# EAGLE design EMS-ESP8266-12 (EAGLE 7.5.1)
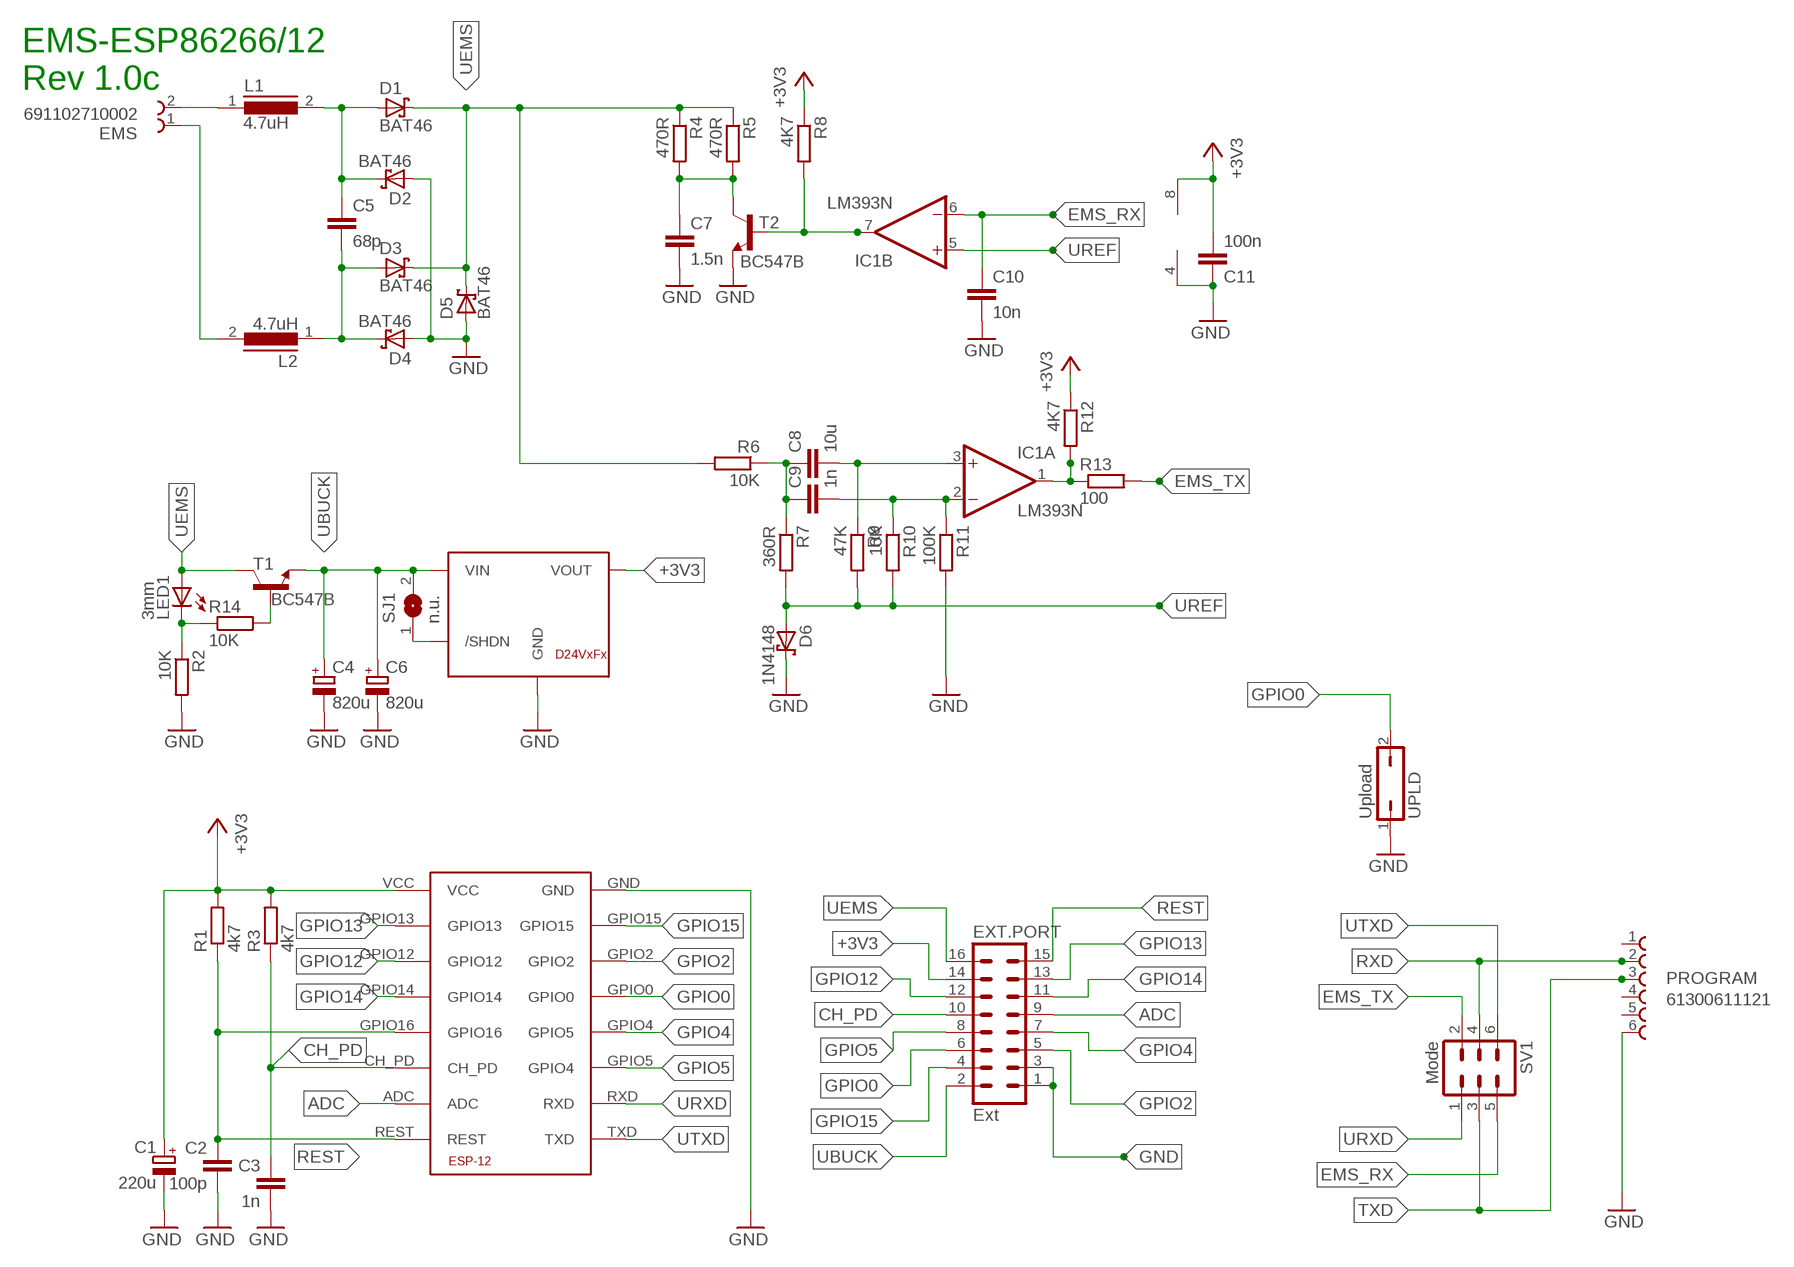
[diagram p0: schematic, sheet 1]

## Parts
C1  220u  CPOL-EUUD-6,3X8,8  [UD-6,3X5,8_NICHICON]
C2  100p  C2.5/2  [C2.5-2]
C3  1n  C2.5/2  [C2.5-2]
C4  820u  CPOL-EUUD-10X10  [UD-10X10_NICHICON]
C5  68p  C-EU025-050X050  [C025-050X050]
C6  820u  CPOL-EUUD-10X10  [UD-10X10_NICHICON]
C7  1.5n  C2.5/2  [C2.5-2]
C8  10u  C5/11  [C5B11]
C9  1n  C2.5/2  [C2.5-2]
C10  10n  C2.5/2  [C2.5-2]
C11  100n  C2.5/2  [C2.5-2]
D1  BAT46  SCHOTTKY-DIODEDO35-7  [DO35-7]
D2  BAT46  SCHOTTKY-DIODEDO35-7  [DO35-7]
D3  BAT46  SCHOTTKY-DIODEDO35-7  [DO35-7]
D4  BAT46  SCHOTTKY-DIODEDO35-7  [DO35-7]
D5  BAT46  SCHOTTKY-DIODEDO35-7  [DO35-7]
D6  1N4148  SCHOTTKY-DIODEDO35-7  [DO35-7]
EMS  691102710002  [691102710002]
ESP1  ESP-12ESP-12  [ESP-12]
EXT.PORT  Ext  MA08-2  [MA08-2]
IC1  LM393N  [DIL08]
L1  4.7uH  MICC12  [MICC12]
L2  4.7uH  MICC12  [MICC12]
LED1  3mm  LED3MM  [LED3MM]
MOD1  D24V3F3  D24VXFX  [D24VXFX]
PROGRAM  61300611121  [61300611121]
R1  4k7  R-EU_0204/7  [0204/7]
R2  10K  R-EU_0204/7  [0204/7]
R3  4k7  R-EU_0204/7  [0204/7]
R4  470R  R-EU_0204/7  [0204/7]
R5  470R  R-EU_0204/7  [0204/7]
R6  10K  R-EU_0204/7  [0204/7]
R7  360R  R-EU_0204/7  [0204/7]
R8  4K7  R-EU_0204/7  [0204/7]
R9  47K  R-EU_0204/7  [0204/7]
R10  10K  R-EU_0204/7  [0204/7]
R11  100K  R-EU_0204/7  [0204/7]
R12  4K7  R-EU_0204/7  [0204/7]
R13  100  R-EU_0204/7  [0204/7]
R14  10K  R-EU_0204/7  [0204/7]
SJ1  n.u.  SJ  [SJ]
SV1  Mode  MA03-2  [MA03-2]
T1  BC547B  -NPN-TO92  [TO92]
T2  BC547B  -NPN-TO92  [TO92]
UPLD  Upload  JP1Q  [JP1]

## Nets
+3V3 [pwr]: C1.+ C11.2 ESP1.VCC EXT.PORT.14 IC1.8(P:V+) MOD1.VOUT R1.2 R3.2 R8.1 R12.1
ADC [signal]: ESP1.ADC EXT.PORT.9
CH_PD [signal]: C3.1 ESP1.CH_PD EXT.PORT.10 R3.1
EMS_RX [signal]: C10.1 IC1.6(B:-IN) SV1.5
EMS_TX [signal]: R13.2 SV1.2
GND [pwr]: C1.- C2.2 C3.2 C4.- C6.- C7.2 C10.2 C11.1 D2.A D4.A D5.A D6.C ESP1.GND EXT.PORT.1 EXT.PORT.3 IC1.4(P:V-) MOD1.GND PROGRAM.6 R2.2 R11.2 T2.1(E) UPLD.1
GPIO0 [signal]: ESP1.GPIO0 EXT.PORT.6 UPLD.2
GPIO2 [signal]: ESP1.GPIO2 EXT.PORT.5
GPIO4 [signal]: ESP1.GPIO4(GPIO5) EXT.PORT.7
GPIO5: ESP1.GPIO5(GPIO4) EXT.PORT.8
GPIO12 [signal]: ESP1.GPIO12 EXT.PORT.12
GPIO13 [signal]: ESP1.GPIO13 EXT.PORT.13
GPIO14 [signal]: ESP1.GPIO14 EXT.PORT.11
GPIO15: ESP1.GPIO15 EXT.PORT.4
N$1 [pwr]: C5.1 D1.A D2.C L1.2
N$2 [pwr]: C5.2 D3.A D4.C L2.1
N$3: MOD1./SHDN SJ1.1
N$4 [pwr]: EMS.2 L1.1
N$5: IC1.1(A:OUT) R12.2 R13.1
N$6 [pwr]: C7.1 R4.2 R5.2 T2.3(C)
N$7: C8.1 C9.1 R6.1 R7.1
N$8 [pwr]: EMS.1 L2.2
N$9: C8.2 IC1.3(A:+IN) R9.1
N$10: R14.2 T1.2(B)
N$12: C9.2 IC1.2(A:-IN) R10.1 R11.1
N$15: IC1.7(B:OUT) R8.2 T2.2(B)
N$17: LED1.K(C) R2.1 R14.1
REST [signal]: C2.1 ESP1.GPIO16 ESP1.REST EXT.PORT.15 R1.1
RXD [signal]: PROGRAM.2 SV1.4
TXD [signal]: PROGRAM.3 SV1.3
UBUCK [pwr]: C4.+ C6.+ EXT.PORT.2 MOD1.VIN SJ1.2 T1.1(E)
UEMS [pwr]: D1.C D3.C D5.C EXT.PORT.16 LED1.A R4.1 R5.1 R6.2 T1.3(C)
UREF: D6.A IC1.5(B:+IN) R7.2 R9.2 R10.2
URXD [signal]: ESP1.RXD SV1.1
UTXD: ESP1.TXD SV1.6
Unconnected: PROGRAM.1 PROGRAM.4 PROGRAM.5

## Notes on the sheet
- EMS-ESP86266/12
  Rev 1.0c

## Library data of the parts
C1 = rcl:CPOL-EU: POLARIZED CAPACITOR, European symbol; REICHELT: VF 220/6,3 P-D
C2 = capacitor-wima:C: CAPACITOR naming: grid - package width; REICHELT: KERKO 100P
C3 C9 = capacitor-wima:C: CAPACITOR naming: grid - package width; REICHELT: X7R-2,5 1,0N
C4 C6 = rcl:CPOL-EU: POLARIZED CAPACITOR, European symbol; REICHELT: VF 820/16 P-G
C5 = resistor:C-EU: CAPACITOR, European symbol; REICHELT: KERKO 68P
C7 = capacitor-wima:C: CAPACITOR naming: grid - package width; REICHELT: X7R-2,5 1,5N
C8 = capacitor-wima:C: CAPACITOR naming: grid - package width; ALTERNATIV: SMD 10uF Keramik; CONRAD: 450662-62; REICHELT: X7R-G1206 10/16
C10 = capacitor-wima:C: CAPACITOR naming: grid - package width; REICHELT: X7R-2,5 10N
C11 = capacitor-wima:C: CAPACITOR naming: grid - package width; REICHELT: X7R-2,5 100N
D1-D4 = diode:SCHOTTKY-DIODE: Schottky Diode; ALTERNATIV: 1/2 BAT54S; REICHELT: BAT 46
D5 = diode:SCHOTTKY-DIODE: Schottky Diode; REICHELT: BAT 46
D6 = diode:SCHOTTKY-DIODE: Schottky Diode; REICHELT: 1N 4148
EMS = EagleLibrary_Wuerth_Elektronik_eiCan_Terminal_Blocks_Connectors_v6_20150113:691102710002: WR-TBL Serie 102 - 5.0mm Horizontal Entry Modular with Pressure Clamp - 1.5mm2 Wires, 2 Pins=>Code : Con_TBL_Screw_PressureClamp_691102710002 <http://katalog.we-online.de/media/images/eican/Con_TBL_Screw_PressureClamp_6911027100xx_pf2.jpg> Details see: http://katalog.we-online.de/en/em/691_102_710_0xx Created 2014-06-17, Karrer Zheng 2014 (C) Würth Elektronik; REICHELT: AKL 055-02
ESP1 = ESP8266-ESP12:ESP-12: low cost Wifi to Serial Module; AI-THINKER: ESP-12
EXT.PORT = con-lstb:MA08-2: PIN HEADER; OC_FARNELL: unknown; OC_NEWARK: unknown; REICHELT: MPE 087-2-016
IC1 = linear:LM393: COMPARATOR; REICHELT: LM 393 DIP
L1 L2 = inductors:MICC12: INDUCTOR; REICHELT: SMCC 4,70µ
LED1 = led:LED: LED OSRAM: - CHIPLED LG R971, LG N971, LY N971, LG Q971, LY Q971, LO R971, LY R971 LH N974, LH R974 LS Q976, LO Q976, LY Q976 LO Q996 - Hyper CHIPLED LW Q18S LB Q993, LB Q99A, LB R99A - SideLED LS A670, LO A670, LY A670, LG A670, LP A670 LB A673, LV A673, LT A673, LW A673 LH A674 LY A675 LS A676, LA A676, LO A676, LY A676, LW A676 LS A679, LY A679, LG A679 - Hyper Micro SIDELED® LS Y876, LA Y876, LO Y876, LY Y876 LT Y87S - SmartLED LW L88C, LW L88S LB L89C, LB L89S, LG L890 LS L89K, LO L89K, LY L89K LS L896, LA L896, LO L896, LY L896 - TOPLED LS T670, LO T670, LY T670, LG T670, LP T670 LSG T670, LSP T670, LSY T670, LOP T670, LYG T670 LG T671, LOG T671, LSG T671 LB T673, LV T673, LT T673, LW T673 LH T674 LS T676, LA T676, LO T676, LY T676, LB T676, LH T676, LSB T676, LW T676 LB T67C, LV T67C, LT T67C, LS T67K, LO T67K, LY T67K, LW E67C LS E67B, LA E67B, LO E67B, LY E67B, LB E67C, LV E67C, LT E67C LW T67C LS T679, LY T679, LG T679 LS T770, LO T770, LY T770, LG T770, LP T770 LB T773, LV T773, LT T773, LW T773 LH T774 LS E675, LA E675, LY E675, LS T675 LS T776, LA T776, LO T776, LY T776, LB T776 LHGB T686 LT T68C, LB T68C - Hyper Mini TOPLED® LB M676 - Mini TOPLED Santana® LG M470 LS M47K, LO M47K, LY M47K Source: http://www.osram.convergy.de LUXEON: - LUMILED® LXK2-PW12-R00, LXK2-PW12-S00, LXK2-PW14-U00, LXK2-PW14-V00 LXK2-PM12-R00, LXK2-PM12-S00, LXK2-PM14-U00 LXK2-PE12-Q00, LXK2-PE12-R00, LXK2-PE12-S00, LXK2-PE14-T00, LXK2-PE14-U00 LXK2-PB12-K00, LXK2-PB12-L00, LXK2-PB12-M00, LXK2-PB14-N00, LXK2-PB14-P00, LXK2-PB14-Q00 LXK2-PR12-L00, LXK2-PR12-M00, LXK2-PR14-Q00, LXK2-PR14-R00 LXK2-PD12-Q00, LXK2-PD12-R00, LXK2-PD12-S00 LXK2-PH12-R00, LXK2-PH12-S00 LXK2-PL12-P00, LXK2-PL12-Q00, LXK2-PL12-R00 Source: www.luxeon.com KINGBRIGHT: KA-3528ASYC Source: www.kingbright.com; REICHELT: LED 3MM ST RT
MOD1 = buckconv:D24VXFX: Step-Down Spannungsregler Hersteller: Pololu Maximum operating voltage: 42 V Maximum output current: 300 mA (D24V3Fx) 600 mA (D24V6Fx) Maximum quiescent current: 2 mA; POLOLU: D24V3F3
PROGRAM = EagleLibrary_Wuerth_Elektronik_eiCan_Board_to_Board_Connectors_v6_20150113:61300611121: WR-PHD 2.54mm Pin Header, 6 Pin =>Code : Con_BTB_PHD_2.54_1_THT_61300611121 <http://katalog.we-online.de/media/images/eican/Con_BTB_PHD_2.54_1_THT_6130xx11121_pf2.jpg> Details see: http://katalog.we-online.de/en/em/613_0xx_111_21 Created 2014-05-29, Karrer Zheng 2014 (C) Würth Elektronik; REICHELT: MPE 087-1-006
R1 R3 R8 R12 = resistor:R-EU_: RESISTOR, European symbol; REICHELT: METALL 4,70K
R2 R6 R10 R14 = resistor:R-EU_: RESISTOR, European symbol; REICHELT: METALL 10,0K
R4 R5 = resistor:R-EU_: RESISTOR, European symbol; REICHELT: METALL 470
R7 = resistor:R-EU_: RESISTOR, European symbol; REICHELT: METALL 360
R9 = resistor:R-EU_: RESISTOR, European symbol; REICHELT: METALL 47,0K
R11 = resistor:R-EU_: RESISTOR, European symbol; REICHELT: METALL 100K
R13 = resistor:R-EU_: RESISTOR, European symbol; REICHELT: METALL 100
SJ1 = jumper:SJ: SMD solder JUMPER
SV1 = con-lstb:MA03-2: PIN HEADER; OC_FARNELL: unknown; OC_NEWARK: unknown; REICHELT: MPE 087-2-006
T1 T2 = transistor:*-NPN-: NPN Transistror BF959 corrected 2008.03.06; REICHELT: BC 547B
UPLD = jumper:JP1Q: JUMPER; REICHELT: MPE 087-1-002

## Net classes
0 default: width 0.254 mm, drill 0.2 mm, clearance 0.254 mm
1 pwr: width 0.508 mm, drill 0.2 mm, clearance 0.205 mm to class 0, clearance 0.254 mm
2 signal: width 0.254 mm, drill 0.2 mm, clearance 0.205 mm to class 0, clearance 0.205 mm to class 1, clearance 0.205 mm

## Board
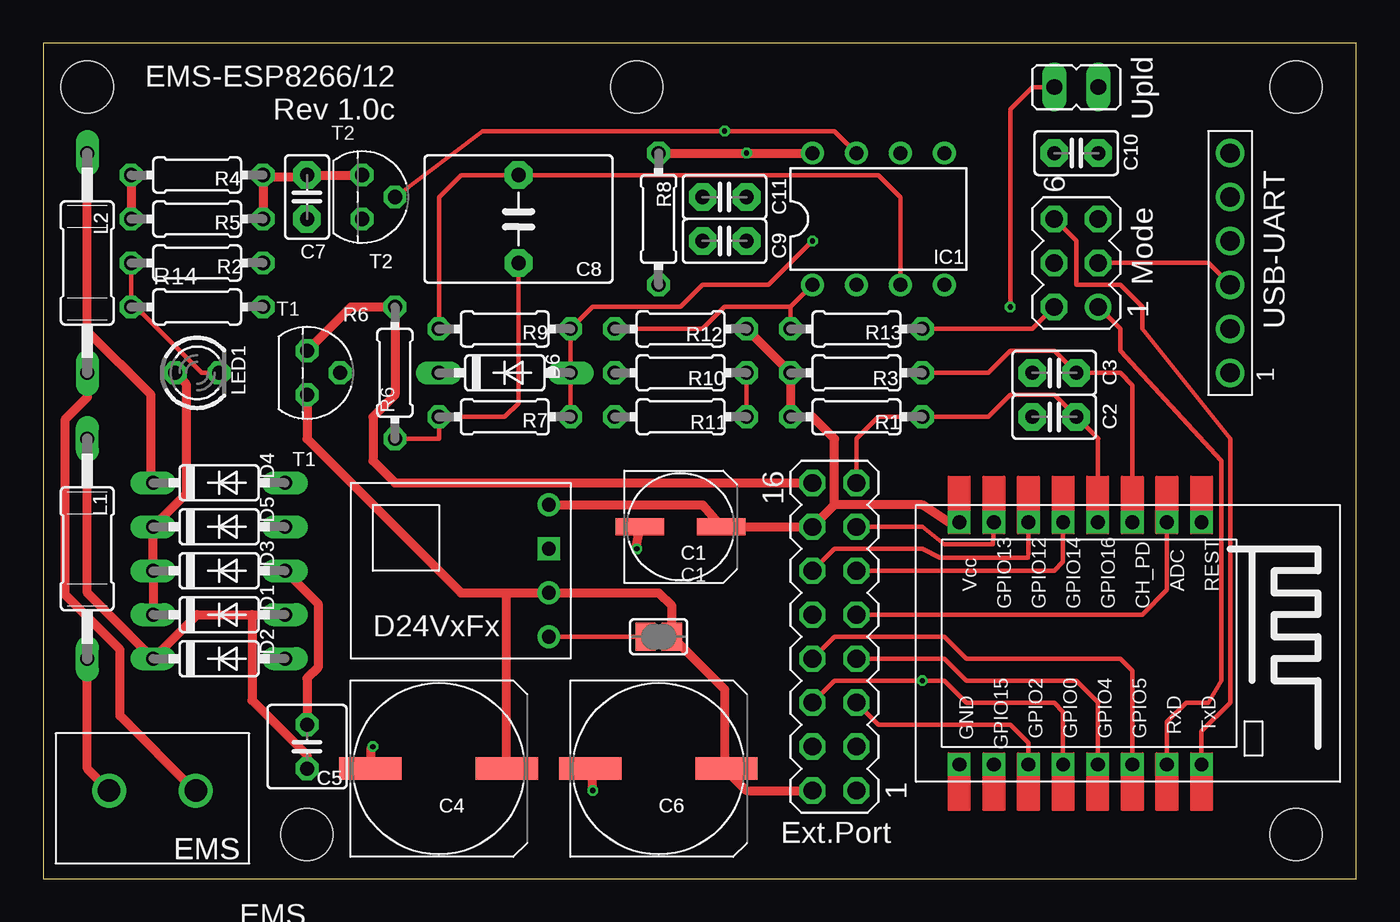
[diagram p1: board, top side]
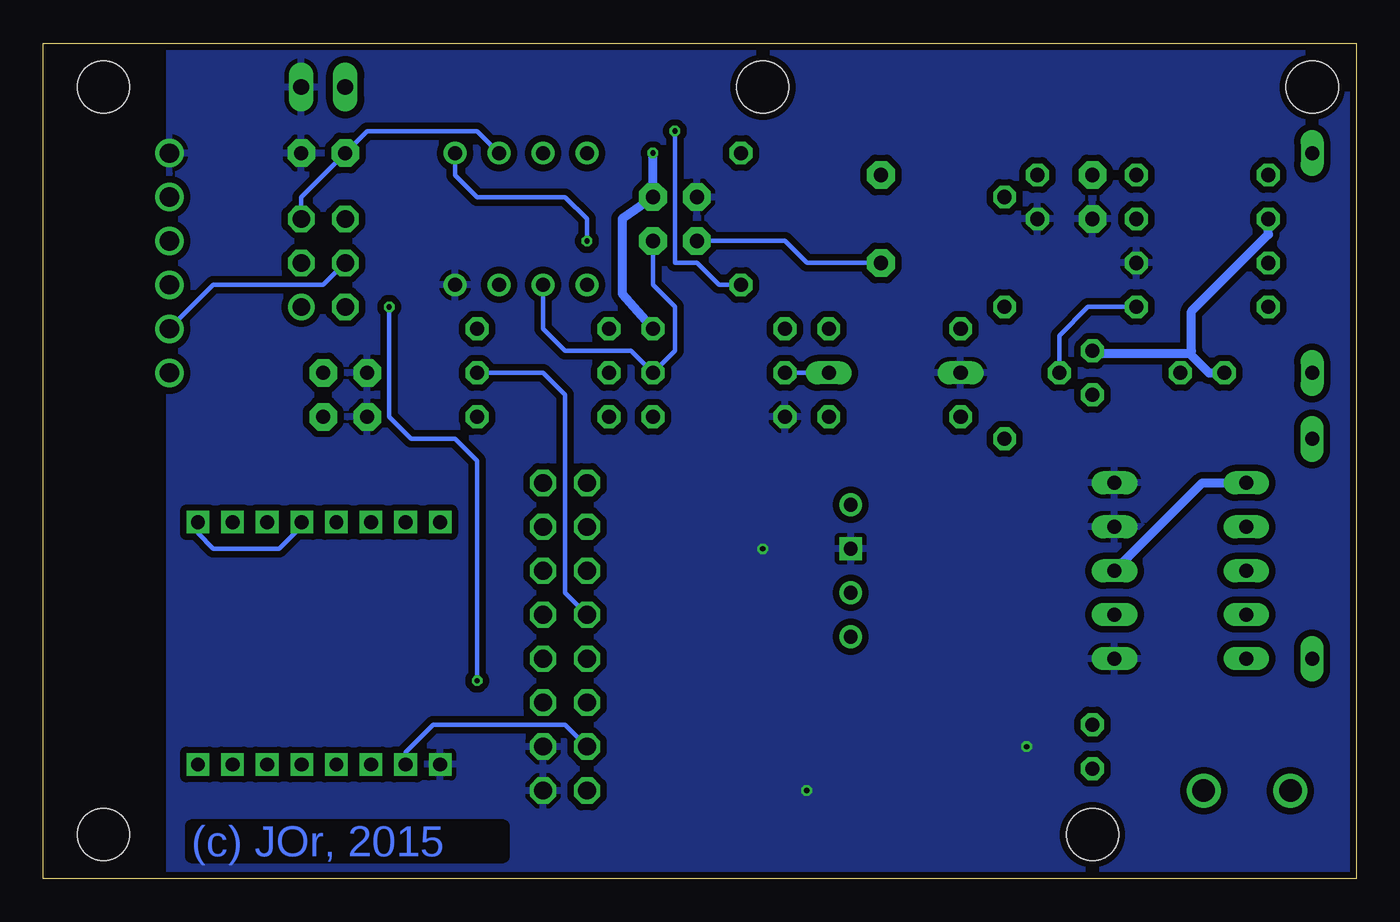
[diagram p2: board, bottom side, seen from below]

Size 75.87 x 48.25 mm. Coordinates in mm from the lower left corner, seen from the top.
Outline: 0,0 75.87,0 75.87,48.25 0,48.25 0,0
Copper layers (1*16): Top 0.035mm / dielectric 1.5mm / Bottom 0.035mm
Design rules "EMS-ESP8266-12": minimum track width 5mil, minimum drill 12mil, track to track 0.205mm, track to pad 0.205mm, pad to pad 0.205mm, via to via 0.205mm, smd to smd 0mil, copper to edge 10mil, drill to drill 10mil, minimum pad ring 10mil, minimum via ring 6mil, stop-mask expansion 2mil, vias tented up to drill 25mil, thermal gap 10mil
Holes 3 mm at 2.54,45.72 72.39,45.72 72.39,2.54 34.29,45.72 15.24,2.54

### Footprints (pad centres in the part's own frame; a part is rotated, then mirrored left to right if it is on the bottom)
UD-6,3X5,8_NICHICON = smd 2.8 x 1: + 2.35,0; - -2.35,0
C2.5-2 = drill 0.813 pad 1.6 octagon: 1 -1.27,0; 2 1.27,0
UD-10X10_NICHICON = smd 3.6 x 1.3: + 3.925,0; - -3.95,0
C025-050X050 = drill 0.813 octagon: 1 -1.27,0; 2 1.27,0
C5B11 = drill 0.813 pad 1.6 octagon: 1 1.27,5.56; 2 6.35,5.56
DO35-7 = drill 0.813 long: A 3.81,0; C -3.81,0
691102710002 = drill 1.3: 1 -5,0; 2 0,0
ESP-12 = drill 0.8 square: ADC 10,1; CH_PD 12,1; GND 22,15; GPIO0 16,15; GPIO2 18,15; GPIO4 14,15; GPIO5 12,15; GPIO12 18,1; GPIO13 20,1; GPIO14 16,1; GPIO15 20,15; GPIO16 14,1; REST 8,1; RXD 10,15; TXD 8,15; VCC 22,1
MA08-2 = drill 1.016 octagon: 1 -8.89,-1.27; 2 -8.89,1.27; 3 -6.35,-1.27; 4 -6.35,1.27; 5 -3.81,-1.27; 6 -3.81,1.27; 7 -1.27,-1.27; 8 -1.27,1.27; 9 1.27,-1.27; 10 1.27,1.27; 11 3.81,-1.27; 12 3.81,1.27; 13 6.35,-1.27; 14 6.35,1.27; 15 8.89,-1.27; 16 8.89,1.27
DIL08 = drill 0.813 pad 1.27: 1 -3.81,-3.81; 2 -1.27,-3.81; 3 1.27,-3.81; 4 3.81,-3.81; 5 3.81,3.81; 6 1.27,3.81; 7 -1.27,3.81; 8 -3.81,3.81
MICC12 = drill 0.813 long: 1 -6.35,0; 2 6.35,0
LED3MM = drill 0.813 octagon: A -1.27,0; K 1.27,0
D24VXFX = drill 0.8: /SHDN 11.43,1.27; VIN 11.43,3.81; VOUT 11.43,8.89 | drill 0.8 square: GND 11.43,6.35
61300611121 = drill 1.1: 1 -6.35,0; 2 -3.81,0; 3 -1.27,0; 4 1.27,0; 5 3.81,0; 6 6.35,0
0204/7 = drill 0.813 octagon: 1 -3.81,0; 2 3.81,0
SJ = smd 1.168 x 1.6: 1 -0.762,0; 2 0.762,0
MA03-2 = drill 1.016: 1 -2.54,-1.27 | drill 1.016 octagon: 2 -2.54,1.27; 3 0,-1.27; 4 0,1.27; 5 2.54,-1.27; 6 2.54,1.27
TO92 = drill 0.813 octagon: 1 1.27,0; 2 0,1.905; 3 -1.27,0
JP1 = drill 0.914 long: 1 0,-1.27; 2 0,1.27

### Placement (x,y rotation side)
C1  36.83,20.32 0 top
C2  58.42,26.67 180 top
C3  58.42,29.21 180 top
C4  22.86,6.35 0 top
C5  15.24,7.62 90 top
C6  35.56,6.35 0 top
C7  15.24,39.37 270 top
C8  33.02,34.29 90 top
C9  39.37,36.83 0 top
C10  59.69,41.91 0 top
C11  39.37,39.37 0 top
D1  10.16,15.24 0 top
D2  10.16,12.7 0 top
D3  10.16,17.78 0 top
D4  10.16,22.86 0 top
D5  10.16,20.32 0 top
D6  26.67,29.21 0 top
EMS  3.81,5.08 180 top
ESP1  74.93,21.59 180 top
EXT.PORT  45.72,13.97 90 top
IC1  48.26,38.1 0 top
L1  2.54,19.05 90 top
L2  2.54,35.56 270 top
LED1  8.89,29.21 0 top
MOD1  17.78,12.7 0 top
PROGRAM  68.58,35.56 90 top
R1  46.99,26.67 180 top
R2  8.89,35.56 0 top
R3  46.99,29.21 180 top
R4  8.89,40.64 0 top
R5  8.89,38.1 0 top
R6  20.32,29.21 90 top
R7  26.67,26.67 0 top
R8  35.56,38.1 270 top
R9  26.67,31.75 0 top
R10  36.83,29.21 180 top
R11  36.83,26.67 180 top
R12  36.83,31.75 180 top
R13  46.99,31.75 0 top
R14  8.89,33.02 0 top
SJ1  35.56,13.97 0 top
SV1  59.69,35.56 90 top
T1  15.24,29.21 270 top
T2  18.41,39.37 270 top
UPLD  59.69,45.72 90 top

### Tracks (layer width: path | path; a pad name or v marks a point on that pad's centre or on a via)
+3V3  (via drill 0.3)
  Top 0.508: ESP1.VCC 52.34,20.59 50.8,21.59 45.72,21.59 | 45.72,21.59 45.72,25.4 44.45,26.67 R1.2 R3.2 R12.1 | R8.1 v40.64,41.91 IC1.8 | 45.72,21.59 EXT.PORT.14 C1.+ 38.1,21.59 MOD1.VOUT
  Bottom 0.508: R12.1 42.42,33.78 42.42,38.1 C11.2 v40.64,41.91
ADC
  Top 0.254: ESP1.ADC 64.93,16.67 63.5,15.24 EXT.PORT.9
CH_PD
  Top 0.254: ESP1.CH_PD 62.93,28.51 62.23,29.21 C3.1 58.42,30.48 55.88,30.48 54.61,29.21 R3.1
  Bottom 0.254: EXT.PORT.10 45.72,16.51 45.72,27.94 46.99,29.21 R3.1
EMS_RX
  Bottom 0.254: IC1.6 50.8,43.18 57.15,43.18 C10.1 60.96,39.37 SV1.5
EMS_TX
  Top 0.254: R13.2 57.15,31.75 SV1.2
GND  (via drill 0.3)
  Top 0.508: v19.05,7.62 18.92,7.49 18.92,6.35 C4.- | v31.75,5.08 31.75,6.49 C6.- | v34.29,19.05 34.29,19.24 C1.-
  pour Bottom (isolate 0.381): 0,48.26 68.58,48.26 68.58,0 0,0
GPIO0  (via drill 0.3)
  Top 0.254: ESP1.GPIO0 58.93,9.65 58.42,10.16 53.34,10.16 52.07,11.43 v50.8,11.43 45.72,11.43 EXT.PORT.6 | UPLD.2 57.15,45.72 55.88,44.45 v55.88,33.02
  Bottom 0.254: v50.8,11.43 50.8,24.13 52.07,25.4 54.61,25.4 55.88,26.67 v55.88,33.02
GPIO2
  Top 0.254: ESP1.GPIO2 56.93,7.84 55.88,8.89 48.26,8.89 EXT.PORT.5
GPIO4
  Top 0.254: ESP1.GPIO4 60.93,10.13 60.96,10.16 59.69,11.43 53.34,11.43 52.07,12.7 EXT.PORT.7
GPIO5
  Top 0.254: ESP1.GPIO5 62.93,12 62.23,12.7 53.34,12.7 52.07,13.97 45.72,13.97 EXT.PORT.8
GPIO12
  Top 0.254: ESP1.GPIO12 56.93,18.83 56.9,18.54 51.82,18.54 50.8,19.05 45.72,19.05 EXT.PORT.12
GPIO13
  Top 0.254: ESP1.GPIO13 54.86,19.3 52.07,19.3 50.8,20.32 EXT.PORT.13
GPIO14
  Top 0.254: ESP1.GPIO14 58.93,18.29 58.42,17.78 EXT.PORT.11
GPIO15
  Bottom 0.254: EXT.PORT.4 45.72,8.89 53.34,8.89 54.93,7.3 ESP1.GPIO15
N$1
  Top 0.508: L1.2 2.54,16.51 D2.C 8.89,15.24 12.06,15.24 | 12.06,15.24 D1.A | C5.1 15.24,7.11 12.06,10.29 12.06,15.24
N$2
  Top 0.508: L2.1 2.54,31.62 6.22,27.94 6.22,22.99 D4.C | C5.2 15.24,11.56 15.88,12.19 15.88,15.88 D3.A
  Bottom 0.508: D4.C 8.89,22.86 D3.A
N$3
  Top 0.254: MOD1./SHDN SJ1.1
N$4
  Top 0.508: L1.1 2.54,6.35 EMS.2
N$5
  Top 0.254: IC1.1 43.18,33.02 | 43.18,33.02 R13.1 | R12.2 38.1,31.75 39.37,33.02 43.18,33.02
N$6
  Top 0.508: R5.2 R4.2 12.83,40.51 15.11,40.51 C7.1 T2.3
N$7
  Top 0.254: R6.1 22.86,25.4 R7.1 26.67,26.67 27.46,27.46 C8.1
  Bottom 0.254: C8.1 31.75,35.56 33.02,36.83 C9.1
N$8
  Top 0.508: L2.2 2.54,27.81 1.27,26.54 1.27,16.38 4.45,13.21 4.45,9.4 8.76,5.08 EMS.1
N$9
  Top 0.254: R9.1 22.86,39.37 24.13,40.64 C8.2 48.26,40.64 49.53,39.37 IC1.3
N$10
  Bottom 0.254: R14.2 15.49,33.02 17.14,31.37 T1.2
N$12
  Top 0.254: R11.1 R10.1
  Bottom 0.254: IC1.2 46.99,31.75 45.72,30.48 41.91,30.48 R10.1 39.37,30.48 39.37,33.02 40.64,34.29 C9.2
N$15  (via drill 0.3)
  Top 0.254: T2.2 25.4,43.18 v39.37,43.18 45.72,43.18 IC1.7
  Bottom 0.254: R8.2 36.83,34.29 38.1,35.56 39.37,35.56 v39.37,43.18
N$17
  Top 0.254: LED1.K 9.14,29.21 5.33,33.02 R14.1 R2.1
REST
  Top 0.254: ESP1.GPIO16 60.93,25.37 60.96,25.4 C2.1 58.42,27.94 55.88,27.94 54.61,26.67 R1.1 48.26,26.67 46.99,25.4 EXT.PORT.15
  Bottom 0.254: ESP1.GPIO16 60.93,20.35 62.23,19.05 66.04,19.05 66.93,19.94 ESP1.REST
RXD
  Bottom 0.254: SV1.4 59.69,34.29 66.04,34.29 PROGRAM.2
TXD
  Top 0.254: SV1.3 67.31,35.56 PROGRAM.3
UBUCK
  Top 0.508: EXT.PORT.2 40.64,5.08 39.48,6.24 C6.+ 39.37,6.48 39.37,10.92 SJ1.2 36.32,15.75 35.56,16.51 MOD1.VIN 26.67,16.51 | T1.1 15.24,25.4 24.13,16.51 26.67,16.51 | C4.+ 26.79,16.39 26.67,16.51
UEMS
  Top 0.508: R4.1 R5.1 | D1.C D3.C D5.C 8.26,22.23 8.26,28.57 LED1.A | T1.3 17.78,33.02 R6.2 20.32,27.94 19.05,26.67 19.05,24.13 20.32,22.86 EXT.PORT.16
  Bottom 0.508: LED1.A 8.51,29.21 9.65,30.35 | 9.65,30.35 15.11,30.35 T1.3 | R5.1 5.08,37.21 9.53,32.77 9.53,30.48 9.65,30.35
UREF  (via drill 0.3)
  Top 0.254: R7.2 D6.A R9.2 31.75,33.02 36.83,33.02 38.1,34.29 41.91,34.29 v44.45,36.83
  Bottom 0.254: D6.A R10.2 | IC1.5 52.07,40.64 50.8,39.37 45.72,39.37 44.45,38.1 v44.45,36.83
URXD
  Top 0.254: SV1.1 62.23,31.75 62.23,30.48 68.07,24.13 68.07,11.43 67.31,10.16 66.04,10.16 64.93,9.05 ESP1.RXD
UTXD
  Top 0.254: SV1.6 59.69,36.83 59.69,34.29 62.23,34.29 63.5,33.02 63.5,31.75 68.58,25.4 68.58,10.16 66.93,8.51 ESP1.TXD

### Text on the board
Bottom: (c) JOr, 2015
tPlace: Upld | Mode | USB-UART | 1 | Ext.Port
_tNames: EMS-ESP8266/12 / Rev 1.0c | C10 | C10 | R4 | R4 | R8 | R8 | L2 | L2 | C11 | C11 | R5 | R5 | C7 | C7 | T2 | T2 | C8 | C8 | C9 | C9 | IC1 | IC1 | R2 | R2 | R6 | R6 | R12 | R12 | R9 | R9 | R13 | R13 | C3 | C3 | D6 | D6 | R10 | R10 | R3 | R3 | LED1 | LED1 | R11 | R11 | R1 | R1 | C2 | C2 | R7 | R7 | T1 | T1 | D4 | D4 | L1 | L1 | D5 | D5 | D3 | D3 | C1 | C1 | D1 | D1 | D2 | D2 | C5 | C5 | C4 | C4 | C6 | C6 | EMS | EMS